# EAGLE design Satellite_Transceiver_Breakout__Swarm_M138 (EAGLE 9.6.2)
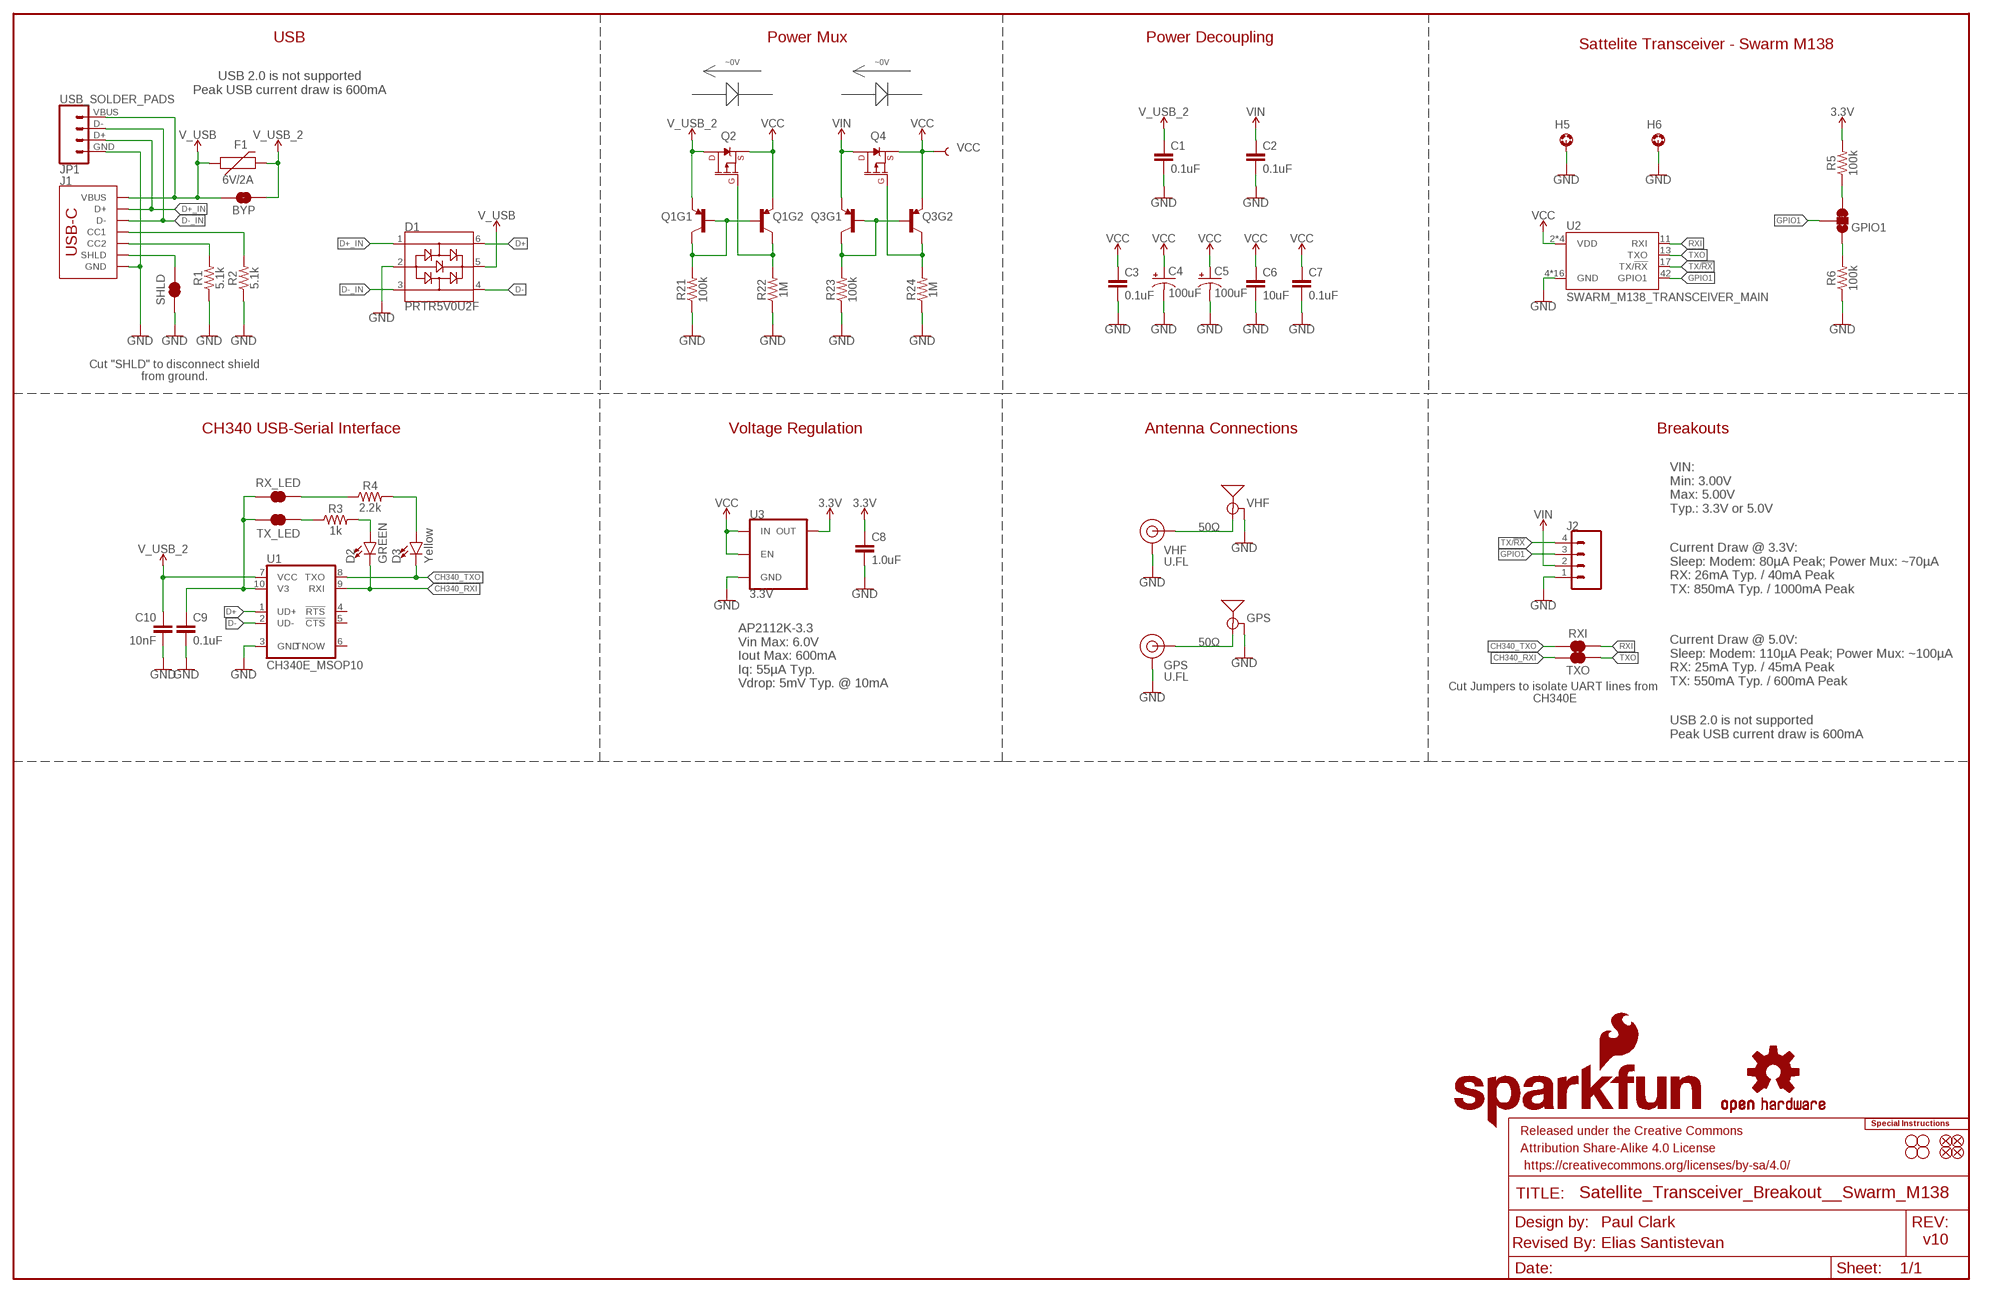
[diagram p0: schematic, sheet 1]

## Parts
BYP  JUMPER-SMT_2_NO_SILK  [SMT-JUMPER_2_NO_SILK]
C1  0.1uF  0.1UF-0603-25V-5%  [0603]
C2  0.1uF  0.1UF-0603-25V-5%  [0603]
C3  0.1uF  0.1UF-0603-25V-5%  [0603]
C4  100uF  100UF-POLAR-25V-20%(ELEC)  [PANASONIC_D]
C5  100uF  100UF-POLAR-25V-20%(ELEC)  [PANASONIC_D]
C6  10uF  10UF-0603-6.3V-20%  [0603]
C7  0.1uF  0.1UF-0603-25V-5%  [0603]
C8  1.0uF  1.0UF-0603-16V-10%-X7R  [0603]
C9  0.1uF  0.1UF-0603-25V-5%  [0603]
C10  10nF  10NF-0603-50V-10%  [0603]
D1  PRTR5V0U2F  [SOT886]
D2  GREEN  LED-GREEN0603  [LED-0603]
D3  Yellow  LED-YELLOW0603  [LED-0603]
E1  VHF  ANTENNA-SMA-GROUNDEDEDGE_SMA  [SMA-EDGE]
E2  GPS  ANTENNA-SMA-GROUNDEDEDGE_SMA  [SMA-EDGE]
F1  6V/2A  PPTC_6V2A  [1210]
FD1  FIDUCIAL1X2  [FIDUCIAL-1X2]
FD2  FIDUCIAL1X2  [FIDUCIAL-1X2]
FD3  FIDUCIAL1X2  [FIDUCIAL-1X2]
FD4  FIDUCIAL1X2  [FIDUCIAL-1X2]
FRAME1  FRAME-LEDGER  [CREATIVE_COMMONS]
GPIO1  JUMPER-SMT_3_1-NC_TRACE_SILK  [SMT-JUMPER_3_1-NC_TRACE_SILK]
GPS  U.FL  U.FL2PIN  [U.FL]
H1  STAND-OFF  [STAND-OFF]
H2  STAND-OFF  [STAND-OFF]
H3  STAND-OFF  [STAND-OFF]
H4  STAND-OFF  [STAND-OFF]
H5  STAND-OFF-REFLOW-M2.5_1.5MM_TALL  [STAND-OFF-REFLOW-M2.5]
H6  STAND-OFF-REFLOW-M2.5_1.5MM_TALL  [STAND-OFF-REFLOW-M2.5]
J1  USB_C_2-LAYER_PADS  [USB-C-16P-2LAYER-PADS]
J2  CONN_041X04_NO_SILK  [1X04_NO_SILK]
JP1  USB_SOLDER_PADS  [USB-SOLDER-PADS]
LOGO1  SPECIAL_INSTRUCTIONS-ORDERING  [ORDERING_INSTRUCTIONS]
LOGO2  OSHW-LOGOM  [OSHW-LOGO-M]
LOGO4  SFE_LOGO_NAME_FLAME.1_INCH  [SFE_LOGO_NAME_FLAME_.1]
Q1  TRANS_PNP_DUALSOT-363  [SOT363_PHILIPS]
Q2  20V/4.2A/52mΩ/1.4W  MOSFET_PCH-DMG2305UX-7  [SOT23-3]
Q3  TRANS_PNP_DUALSOT-363  [SOT363_PHILIPS]
Q4  20V/4.2A/52mΩ/1.4W  MOSFET_PCH-DMG2305UX-7  [SOT23-3]
R1  5.1k  5.1KOHM5.1KOHM-0603-1/10W-1%  [0603]
R2  5.1k  5.1KOHM5.1KOHM-0603-1/10W-1%  [0603]
R3  1k  1KOHM-0603-1/10W-1%  [0603]
R4  2.2k  2.2KOHM-0603-1/10W-1%  [0603]
R5  100k  100KOHM-0603-1/10W-1%  [0603]
R6  100k  100KOHM-0603-1/10W-1%  [0603]
R21  100k  100KOHM-0603-1/10W-1%  [0603]
R22  1M  1MOHM-0603-1/4W-5%  [0603]
R23  100k  100KOHM-0603-1/10W-1%  [0603]
R24  1M  1MOHM-0603-1/4W-5%  [0603]
RX_LED  JUMPER-SMT_2_NC_TRACE_SILK  [SMT-JUMPER_2_NC_TRACE_SILK]
RXI  JUMPER-COMBO_2_NC_TRACE  [COMBO-JUMPER_2_NC_TRACE]
SHLD  JUMPER-SMT_2_NC_TRACE_SILK  [SMT-JUMPER_2_NC_TRACE_SILK]
TX_LED  JUMPER-SMT_2_NC_TRACE_SILK  [SMT-JUMPER_2_NC_TRACE_SILK]
TXO  JUMPER-COMBO_2_NC_TRACE  [COMBO-JUMPER_2_NC_TRACE]
U1  CH340E_MSOP10  [MSOP10]
U2  SWARM_M138_TRANSCEIVER_MAIN  [M.2-SWARM-M138-A]
U3  3.3V  V_REG_AP2112K-3.3V  [SOT23-5]
VCC  TEST-POINT3X5  [PAD.03X.05]
VHF  U.FL  U.FL2PIN  [U.FL]

## Nets
3.3V: C8.1 R5.2 U3.5(OUT)
CH340_RXI: D2.C TXO.2 TXO.4 U1.9(RXI)
CH340_TXO: D3.C RXI.1 RXI.3 U1.8(TXO)
D+: D1.6 U1.1(UD+)
D+_IN: D1.1 J1.A6(D+) J1.B6(D+) JP1.D+
D-: D1.4 U1.2(UD-)
D-_IN: D1.3 J1.A7(D-) J1.B7(D-) JP1.D-
GND: C1.2 C2.2 C3.2 C4.- C5.- C6.2 C7.2 C8.2 C9.2 C10.2 D1.2 E1.GND@0(GND) E1.GND@1(GND) E1.GND@2(GND) E1.GND@3(GND) E2.GND@0(GND) E2.GND@1(GND) E2.GND@2(GND) E2.GND@3(GND) GPS.1(GND) GPS.2(GND) H5.1 H6.1 J1.GND J1.GND2(GND) J2.1 JP1.GND R1.1 R2.1 R6.1 R21.1 R22.1 R23.1 R24.1 SHLD.1 U1.3(GND) U2.4(GND) U2.9(GND) U2.15(GND) U2.18(GND) U2.21(GND) U2.26(GND) U2.27(GND) U2.29(GND) U2.34(GND) U2.35(GND) U2.37(GND) U2.40(GND) U2.43(GND) U2.50(GND) U2.A1(GND) U2.A2(GND) U3.2(GND) VHF.1(GND) VHF.2(GND)
GPIO1: GPIO1.2 J2.3 U2.42(GPIO1)
GPS [RF]: E2.SIG(SIGNAL) GPS.FEED(SIGNAL)
N$2: J1.B5(CC2) R1.2
N$3: J1.A5(CC1) R2.2
N$5: Q1.2(B) Q1.5(B) Q1.6(C) R21.2
N$6: C9.1 RX_LED.1 TX_LED.2 U1.10(V3)
N$7: R4.1 RX_LED.2
N$9: D2.A R3.2
N$10: D3.A R4.2
N$12: R3.1 TX_LED.1
N$13: Q1.3(C) Q2.1(G) R22.2
N$14: GPIO1.3 R5.1
N$15: Q3.2(B) Q3.5(B) Q3.6(C) R23.2
N$16: GPIO1.1 R6.2
N$28: Q3.3(C) Q4.1(G) R24.2
RXI: RXI.2 RXI.4 U2.11(RXI)
SHLD: J1.SHLD1(SHLD) J1.SHLD2(SHLD) J1.SHLD3(SHLD) J1.SHLD4(SHLD) SHLD.2
TX/!RX!: J2.4 U2.17(TX/!RX!)
TXO: TXO.1 TXO.3 U2.13(TXO)
V_USB: BYP.2 D1.5 F1.1 J1.VBUS1(VBUS) J1.VBUS2(VBUS) JP1.VBUS
V_USB_2: BYP.1 C1.1 C10.1 F1.2 Q1.1(E) Q2.3(D) U1.7(VCC)
VCC: C3.1 C4.+ C5.+ C6.1 C7.1 Q1.4(E) Q2.2(S) Q3.4(E) Q4.2(S) U2.2(VDD) U2.39(VDD) U2.41(VDD) U2.52(VDD) U3.1(IN) U3.3(EN) VCC.1
VHF [RF]: E1.SIG(SIGNAL) VHF.FEED(SIGNAL)
VIN: C2.1 J2.2 Q3.1(E) Q4.3(D)
Unconnected: U1.4(!RTS) U1.5(!CTS) U1.6(TNOW)

## Notes on the sheet
- USB | Power Mux | Power Decoupling
- Sattelite Transceiver - Swarm M138
- ~0V | ~0V
- USB 2.0 is not supported
  Peak USB current draw is 600mA
- Cut "SHLD" to disconnect shield
  from ground.
- CH340 USB-Serial Interface | Voltage Regulation | Antenna Connections | Breakouts
- VIN:
  Min: 3.00V
  Max: 5.00V
  Typ.: 3.3V or 5.0V
- 50Ω
- Current Draw @ 3.3V:
  Sleep: Modem: 80µA Peak; Power Mux: ~70µA
  RX: 26mA Typ. / 40mA Peak
  TX: 850mA Typ. / 1000mA Peak
- AP2112K-3.3
  Vin Max: 6.0V
  Iout Max: 600mA
  Iq: 55µA Typ.
  Vdrop: 5mV Typ. @ 10mA
- Current Draw @ 5.0V:
  Sleep: Modem: 110µA Peak; Power Mux: ~100µA
  RX: 25mA Typ. / 45mA Peak
  TX: 550mA Typ. / 600mA Peak
- 50Ω
- Cut Jumpers to isolate UART lines from 
  CH340E
- USB 2.0 is not supported
  Peak USB current draw is 600mA
- Paul Clark
- Revised By: Elias Santistevan | v10

## Library data of the parts
BYP = SparkFun-Jumpers:JUMPER-SMT_2_NO: Normally open jumper This jumper has two pads in close proximity to each other. Apply solder to close the connection. Round pads are easier to solder for beginners, but are a lot larger. SparkFun Product that uses the round pads: SparkFun EL Sequencer <https://www.sparkfun.com/products/12781>
C1-C3 C7 C9 = SparkFun-Capacitors:0.1UF: 0.1µF ceramic capacitors A capacitor is a passive two-terminal electrical component used to store electrical energy temporarily in an electric field.; PROD_ID: CAP-08604
C4 C5 = SparkFun-Capacitors:100UF-POLAR: 100µF polarized capacitors A capacitor is a passive two-terminal electrical component used to store electrical energy temporarily in an electric field.; PROD_ID: CAP-12547
C6 = SparkFun-Capacitors:10UF: 10.0µF ceramic capacitors A capacitor is a passive two-terminal electrical component used to store electrical energy temporarily in an electric field.; PROD_ID: CAP-11015
C8 = SparkFun-Capacitors:1.0UF: 1µF ceramic capacitors A capacitor is a passive two-terminal electrical component used to store electrical energy temporarily in an electric field.; PROD_ID: CAP-13930
C10 = SparkFun-Capacitors:10NF: 0.01uF/10nF/10,000pF ceramic capacitors A capacitor is a passive two-terminal electrical component used to store electrical energy temporarily in an electric field. CAP-09321; PROD_ID: CAP-00867
D1 = SparkFun-IC-Power:PRTR5V0U2: A small ESD protection device. Most commonly used on USB D+/D- signals to protect large, expensive, or especially sensitive USB enabled devices.; PROD_ID: DIO-14084
D2 = SparkFun-LED:LED-GREEN: Green SMD LED Used in manufacturing of various products at SparkFun Packages: 0603 - SMD 0603 package [Product Link] <http://www.futureelectronics.com/en/technologies/semiconductors/optoelectronics/leds/Pages/9894312-LTST-C190GKT.aspx?CrossPart=HSMG-C190&IM=0> LilyPad 1206 - SMD1206 LilyPad package [Product Link] <http://www.futureelectronics.com/en/Technologies/Product.aspx?ProductID=IN150NGHARVATEKCORPORATION2049943&IM=0> 1206 - SMD1206 package [Product Link] <http://www.futureelectronics.com/en/technologies/semiconductors/optoelectronics/leds/Pages/8315665-LTST-C150KGKT.aspx?IM=0> 1206 Bottom Mount -SMD 1206 Bottom Mount [Product Link] <http://www.digikey.com/product-detail/en/lite-on-inc/LTST-C230KGKT/160-1456-1-ND/386854> SparkFun Products: Pro Mini 328 -5V <https://www.sparkfun.com/products/821> RedBoard <https://www.sparkfun.com/products/12757> MP3 Trigger <https://www.sparkfun.com/products/13720> Makey Makey <https://www.sparkfun.com/products/11076>; PROD_ID: DIO-00821
D3 = SparkFun-LED:LED-YELLOW: Yellow SMD LED Used in manufacturing several products at SparkFun. Packages: 0603 - SMD 0603 package[Product Link] <http://www.kingbrightusa.com/product.asp?catalog_name=LED&product_id=APT1608SYCK> 0603 -SMART - SMART SMD 0603 package (more efficient/more expensive) [Product Link] <http://www.osram-os.com/osram_os/en/products/product-catalog/led-light-emitting-diodes/smartled-0603/ly-l29k/index.jsp> LilyPad - SMD1206 package[Product Datasheet] <https://www.sparkfun.com/datasheets/DevTools/LilyPad/Q150YUS4.pdf> SparkFun Products: Blynk Board <https://www.sparkfun.com/products/13794> IOIO-OTG <https://www.sparkfun.com/products/13613> XBee Explorer Serial <https://www.sparkfun.com/products/13225>; PROD_ID: DIO-09003
E1 E2 = SparkFun-RF:ANTENNA-SMA-GROUNDED: SMA Antenna Connector w/ Ground Edge-mount and SMD SMA connectors for RF Antennas. **4-LAYER BOARD WARNING!!** When designing a 4-layer board using any of the SMD variants, you will need to manually add a cutout polygon on any internal power layers to make sure that you don't end up with exposed copper around the edge of the routed hole for these connectors. Exposed power copper could then short to the connector body - and that would be bad. Why hasn't anyone added the cutout polygons directly to the connector footprint? Well, your internal layers (usually 2 and 15) may be covered with GND polygons and you might well want the copper to go all the way to the edge, especially under the connector SIGNAL pin. So adding cutouts to the footprint might make matters worse, not better...; PROD_ID: CONN-08289
F1 = SparkFun-Fuses:PPTC: Resettable Fuse PPTC Resettable Fuse. Really a sort of resistor with a polymeric positive temperature coefficient whose resistance increases dramatically with an increase in temperature. When heated by the power passing through the resistance rises causing the current to be limited, protecting the circuit. This is achieved by the transition of the polymer from a crystalline to an amorphous state where the conductive carbon separates breaking the conductive pathways found in the cool crystalline structure. When a PPTC cools back down it resumes conducting letting the circuit turn back on. SparkFun Products: SparkFun RedBoard - Programmed with Arduino <https://www.sparkfun.com/products/12757> Pro Micro - 5V/16MHz <https://www.sparkfun.com/products/12640> Arduino Pro 328 - 5V/16MHz <https://www.sparkfun.com/products/10915> MP3 Trigger <https://www.sparkfun.com/products/13720>; PROD_ID: RES-14313
FD1-FD4 = SparkFun-Aesthetics:FIDUCIAL: Fiducial Alignment Points Point-of-reference for pick-and-place machines and other optical instruments.
FRAME1 = SparkFun-Aesthetics:FRAME-LEDGER: Schematic Frame - Ledger Standard 11x14 US Ledger frame
GPIO1 = SparkFun-Jumpers:JUMPER-SMT_3_1-NC_TRACE: Normally closed trace jumper (1 of 2 connections) This jumper has a trace between two pads so it's normally closed (NC). The other connection is normally open (NO). Use a razor knife to open the connection. For best results follow the IPC guidelines for cutting traces: Cutout at least 0.063 mm (0.005 in). Remove all loose material to clean up the cut area. Seal the cut with an approved epoxy. Reapply solder to reclose the connection, or to close the NO connection.
GPS VHF = SparkFun-Connectors:U.FL2PIN: SMD Antenna Connector - U.FL 2mm height, 3.0mm x 3.0mm receptacle size. SparkFun Products: SparkFun WiFi Shield - ESP8266 <https://www.sparkfun.com/products/13287> SparkFun ESP8266 Thing <https://www.sparkfun.com/products/13231> SparkFun MiniGen - Pro Mini Signal Generator Shield <https://www.sparkfun.com/products/11420>; PROD_ID: CONN-09193; SF_ID: WRL-09144
H1-H4 = SparkFun-Hardware:STAND-OFF: Stand Off Drill holes for mechanically mounting via screws, standoffs, etc. Note: Use the keepout ring to avoid running the screw head into surrounding components. Variant Overviews STAND-OFF - Mechanical footprint for a #4 phillips button head screw. STAND-OFF-TIGHT - Mechanical footprint for a #4 phillips button head screw, Example SparkFun Products Screw - Phillips Head (1/4", 4-40, 10 pack) <https://www.sparkfun.com/products/10453> (PRT-10453) Screw - Phillips Head (1/2", 4-40, 10 pack) <https://www.sparkfun.com/products/10452> (PRT-10452) Screw - Phillips Head (3/4", 4-40, 10 pack) <https://www.sparkfun.com/products/10451> (PRT-10451) Screw - Phillips Head (1", 4-40, 10 pack) <https://www.sparkfun.com/products/10450> (PRT-10450)
H5 H6 = SparkFun-Hardware:STAND-OFF-REFLOW: Stand Off Reflow Compatible A metal standoff that can be placed and reflowed onto a PCB. The M2.5 x 2.5mm variant is used on MicroMod. The M2.5 x 1.5mm variant is used to hold mPCIe boards, including the Swarm M138. The M2.0 x 6.0mm variant is used to mount the Iridium 9603N modem.; PROD_ID: HW-16629
J1 = SparkFun-Connectors:USB_C: USB Type C 16Pin Connector Super Speed pins not available on the 16-pin purely SMD connector so this part is best for USB 2.0 implementations. D1 and D2 are tied together enabling D+/- no matter which way the cable is plugged into the connector. The two channel configuration pins (CC1/2) are exposed. These are normally connected to ground via 5.1k resistors but can be reconfigured for high current/high power applications. **4-LAYER BOARD WARNING!!** If designing 4-layer board, make sure to select the variant _4-LAYER-ISOLATED. The linked footprint (USB-C-16-4LAYER-ISOLATED) includes some very necessary cutout polygons in the inner layers (2 and 15). This prevents the PTH mounting shield legs on the USB connector from electrically connecting any other polygons on the inner layers (usually VCC and GND).; PROD_ID: CONN-14122
J2 = SparkFun-Connectors:CONN_04: Multi connection point. Often used as Generic Header-pin footprint for 0.1 inch spaced/style header connections On any of the 0.1 inch spaced packages, you can populate with these: Break Away Headers - Straight <https://www.sparkfun.com/products/116> (PRT-00116) Break Away Male Headers - Right Angle <https://www.sparkfun.com/products/553> (PRT-00553) Female Headers <https://www.sparkfun.com/products/115> (PRT-00115) Break Away Headers - Machine Pin <https://www.sparkfun.com/products/117> (PRT-00117) Break Away Female Headers - Swiss Machine Pin <https://www.sparkfun.com/products/743> (PRT-00743) For SCREWTERMINALS and SPRING TERMINALS visit here: Screw Terimnals on SparkFun.com <https://www.sparkfun.com/search/results?term=Screw+Terminals> (5mm/3.5mm/2.54mm spacing) This device is also useful as a general connection point to wire up your design to another part of your project. Our various solder wires solder well into these plated through hole pads. Hook-Up Wire - Assortment (Stranded, 22 AWG) <https://www.sparkfun.com/products/11375> (PRT-11375) Hook-Up Wire - Assortment (Solid Core, 22 AWG) <https://www.sparkfun.com/products/11367> (PRT-11367) View the entire wire category on our website here <https://www.sparkfun.com/categories/141> Special notes: Molex polarized connector foot print use with SKU : PRT-08231 with associated crimp pins and housings. 1MM SMD Version SKU: PRT-10208; PROD_ID: CONN-09696
JP1 = SparkFun-Connectors:USB_SOLDER_PADS: Solder pad access to USB pins. Helpful to expose on PCBs so user can attach external USB connector if necessary.
LOGO1 = SparkFun-Aesthetics:SPECIAL_INSTRUCTIONS: Special Ordering/Production Instructions Alert Symbol for special PCB ordering instructions or unique production process warnings. Ordering Instructions Production Instructions Types of information that should be added to box: Copper weight Soldermask color Silk color PCB thickness Number of layers PCB Standard: 1.6mm FR4 1 oz copper immersion silver plating red soldermask white silkscreen Types of information that should be added to box: Special wash requirements Depaneling instructions Humidification Glue curing Default text settings: 0.07 inch 9% ratio 50% line distance
LOGO2 = SparkFun-Aesthetics:OSHW-LOGO: Open-Source Hardware (OSHW) Logo This logo indicates the piece of hardware it is found on incorporates a OSHW license and/or adheres to the definition of open source hardware found here: http://freedomdefined.org/OSHW
LOGO4 = SparkFun-Aesthetics:SFE_LOGO_NAME_FLAME: SparkFun Font Logo w/ Flame This is the SparkFun full logo. The logo on the schematic will always be the same size; the package variant is the height of the flame part of the logo. Default layer for the logo on the board is tSilk.
Q1 Q3 = SparkFun-DiscreteSemi:TRANS_PNP_DUAL: Dual PNP Transistors in Single Package The BCM857BS puts two PNP transistors in a single package. Bipolar (BJT) Transistor Array 2 PNP (Dual) 45V 100mA 100MHz 200mW Surface Mount SOT-363 Datasheet <https://www.diodes.com/assets/Datasheets/BCM857BS.pdf> SparkFun Products: SparkFun Pi Servo HAT V2 <https://www.sparkfun.com>; PROD_ID: TRANS-14386
Q2 Q4 = SparkFun-DiscreteSemi:MOSFET_PCH: P-channel MOSFETs Voltage controlled devices that allow control of high current outputs. SparkFun Products: SparkFun ESP32 Thing <https://www.sparkfun.com/products/13907> SparkFun ESP8266 Thing <https://www.sparkfun.com/products/13231> SparkFun Pi Servo HAT V2 <https://www.sparkfun.com/products/15316> DMG2305UX-7 (20V/4.2A/SOT23-3); PROD_ID: TRANS-14388
R1 R2 = SparkFun-Resistors:5.1KOHM; PROD_ID: RES-12083
R3 = SparkFun-Resistors:1KOHM: 1kΩ resistor A resistor is a passive two-terminal electrical component that implements electrical resistance as a circuit element. Resistors act to reduce current flow, and, at the same time, act to lower voltage levels within circuits. - Wikipedia; PROD_ID: RES-07856
R4 = SparkFun-Resistors:2.2KOHM: 2.2kΩ resistor A resistor is a passive two-terminal electrical component that implements electrical resistance as a circuit element. Resistors act to reduce current flow, and, at the same time, act to lower voltage levels within circuits. - Wikipedia; PROD_ID: RES-08272
R5 R6 R21 R23 = SparkFun-Resistors:100KOHM: 100kΩ resistor A resistor is a passive two-terminal electrical component that implements electrical resistance as a circuit element. Resistors act to reduce current flow, and, at the same time, act to lower voltage levels within circuits. - Wikipedia; PROD_ID: RES-07828
R22 R24 = SparkFun-Resistors:1MOHM: 1MΩ resistor A resistor is a passive two-terminal electrical component that implements electrical resistance as a circuit element. Resistors act to reduce current flow, and, at the same time, act to lower voltage levels within circuits. - Wikipedia; PROD_ID: RES-07868
RX_LED SHLD TX_LED = SparkFun-Jumpers:JUMPER-SMT_2_NC_TRACE: Normally closed trace jumper This jumper has a trace between two pads so it's normally closed (NC). Use a razor knife to open the connection. For best results follow the IPC guidelines for cutting traces: Cutout at least 0.063 mm (0.005 in). Remove all loose material to clean up the cut area. Seal the cut with an approved epoxy. Reapply solder to reclose the connection.
RXI TXO = SparkFun-Jumpers:JUMPER-COMBO_2_NC_TRACE
U1 = SparkFun-IC-Comms:CH340E; PROD_ID: IC-14135
U2 = SparkFun-RF:SWARM_M138_TRANSCEIVER: Swarm M138 Modem Description: A satellite transceiver based on the mPCIe standard.; PROD_ID: CONN-16558
U3 = SparkFun-IC-Power:V_REG_AP2112: AP2112 - 600mA CMOS LDO Regulator w/ Enable The AP2112 is CMOS process low dropout linear regulator with enable function, the regulator delivers a guaranteed 600mA (min.) continuous load current. Features Output Voltage Accuracy: ±1.5% Output Current: 600mA (Min.) Foldback Short Current Protection: 50mA Enable Function to Turn ON/OFF VOUT Low Dropout Voltage (3.3V): 250mV (Typ.) @IOUT=600mA Excellent Load Regulation: 0.2%/A (Typ.) Excellent Line Regulation: 0.02%/V (Typ.) Low Quiescent Current: 55μA (Typ.) Low Standby Current: 0.01μA (Typ.) Low Output Noise: 50μVRMS PSRR: 100Hz -65dB, 1kHz -65dB OTSD Protection Stable with 1.0μF Flexible Cap: Ceramic, Tantalum and Aluminum Electrolytic Operation Temperature Range: -40°C to 85°C ESD: MM 400V, HBM 4000V; PROD_ID: VREG-12457
VCC = SparkFun-Connectors:TEST-POINT: SparkFun Test Points Bare copper test points for troubleshooting or In-Circuit-Testing. These are used by our Production team for verifying production board runs using pogo-pins on test beds. SparkFun Products: SparkFun LSM9DS1 Breakout <https://www.sparkfun.com/products/13284> SparkFun PSOC <https://www.sparkfun.com/products/13714> SparkFun Load Cell Amplifier <https://www.sparkfun.com/products/13879>

## Net classes
1 RF: clearance 0.254 mm

## Board
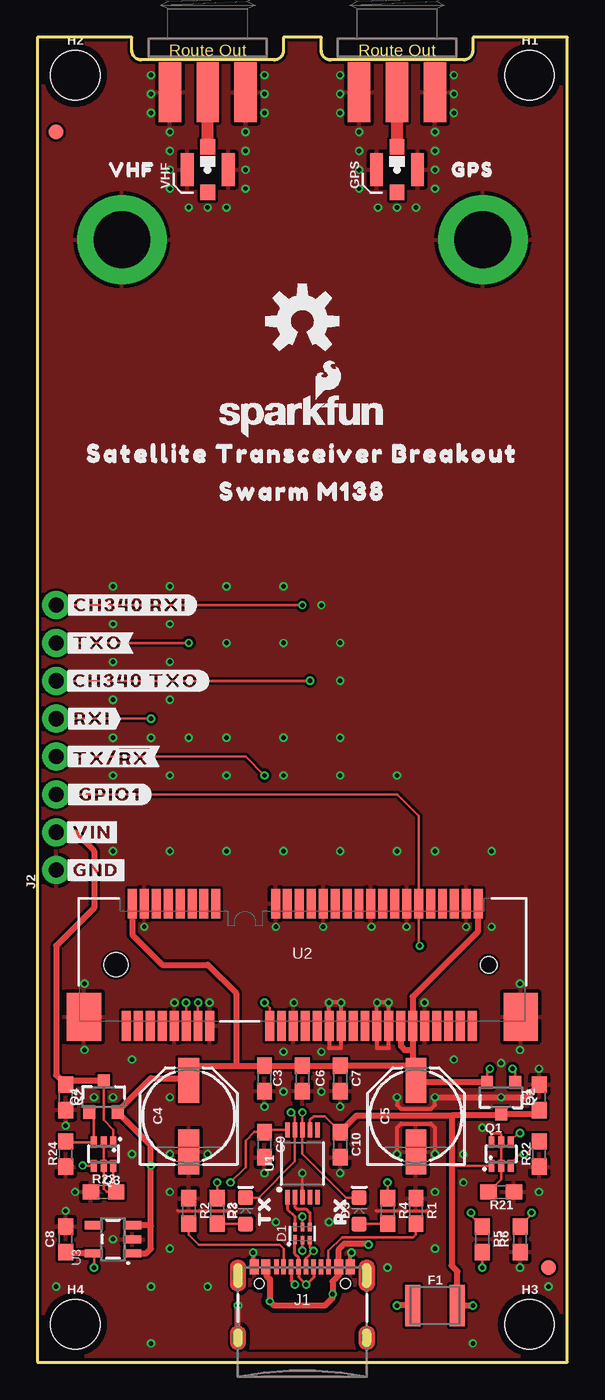
[diagram p1: board, top side]
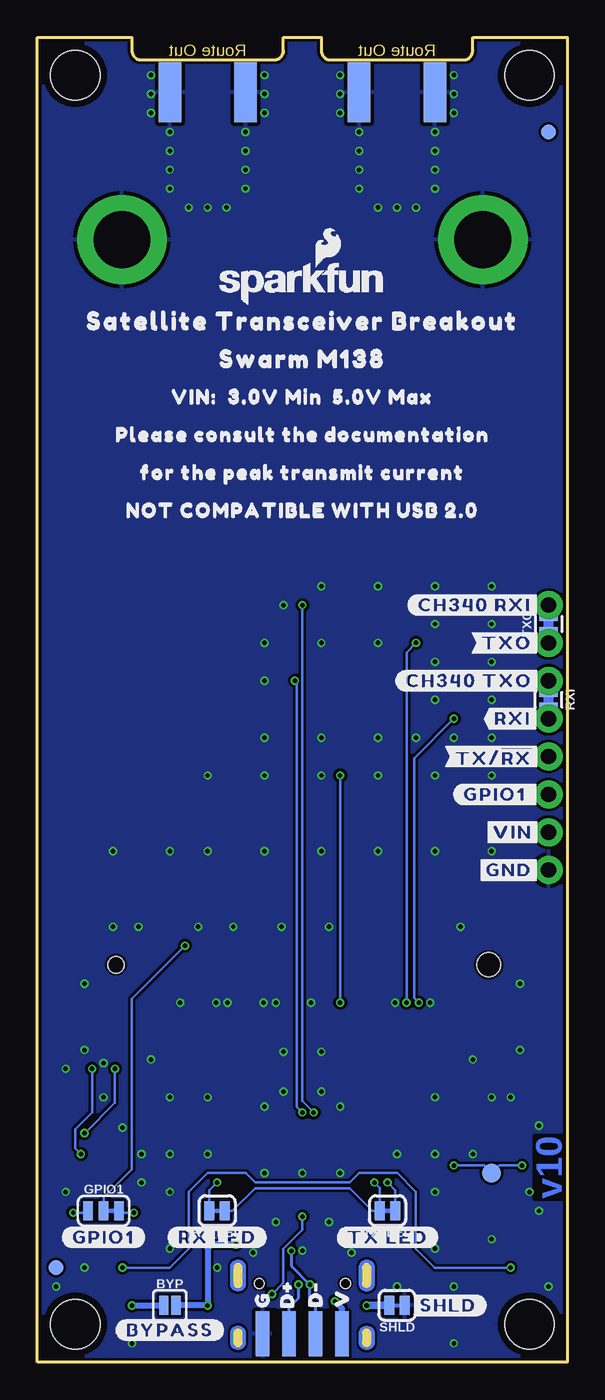
[diagram p2: board, bottom side, seen from below]

Size 35.56 x 88.9 mm. Coordinates in mm from the lower left corner, seen from the top.
Outline: 0,0 35.56,0 35.56,88.9 29.21,88.9 29.21,88.01 arc-90 28.57,87.38 19.68,87.38 arc-90 19.05,88.01 19.05,88.9 16.51,88.9 16.51,88.01 arc-90 15.88,87.38 6.99,87.38 arc-90 6.35,88.01 6.35,88.9 0,88.9 0,0
Copper layers (1*16): Top 0.035mm / dielectric 1.5mm / Bottom 0.035mm
Design rules "SparkFun-2-Layer-Minimum-JLCPCB": minimum track width 5mil, minimum drill 0.3mm, track to track 5mil, track to pad 5mil, pad to pad 5mil, via to via 5mil, smd to smd 5mil, copper to edge 7mil, drill to drill 7mil, minimum pad ring 5mil, minimum via ring 5mil, stop-mask expansion 2.5mil, vias tented up to drill 25mil, thermal gap 10mil
tRestrict: area 10.7,79.1 to 12.2,80.9; area 23.4,79.1 to 24.9,80.9; 4 lines
bRestrict: 3 lines

### Footprints (pad centres in the part's own frame; a part is rotated, then mirrored left to right if it is on the bottom)
SMT-JUMPER_2_NO_SILK = smd 0.635 x 1.27: 1 -0.406,0; 2 0.406,0
0603 = smd 1.1 x 1: 1 -0.85,0; 2 0.85,0
PANASONIC_D = smd 3 x 1.4: + 2.4,0; - -2.4,0
SOT886 = smd 0.61 x 0.25: 1 -0.405,0.5 | smd 0.56 x 0.25: 2 -0.43,0; 3 -0.43,-0.5; 4 0.43,-0.5; 5 0.43,0; 6 0.43,0.5
LED-0603 = smd 1 x 1: A -0.877,0; C 0.877,0
SMA-EDGE = smd 1.5 x 4: GND@0 -2.54,0; GND@1 2.54,0; SIG 0,0 | smd 1.5 x 4 bottom: GND@2 -2.54,0; GND@3 2.54,0
1210 = smd 1 x 2.8: 1 -1.5,0; 2 1.5,0
FIDUCIAL-1X2 = smd 1 x 1: 1 0,0
SMT-JUMPER_3_1-NC_TRACE_SILK = smd 0.66 x 1.27: 1 -1.041,0; 2 0,0; 3 1.041,0
U.FL = smd 2.2 x 0.85: 1 0,1.375; 2 0,-1.375 | smd 1.05 x 1: FEED 1.525,0; NC -1.525,0
STAND-OFF = hole 3.302: 0,0
STAND-OFF-REFLOW-M2.5 = drill 3.8 pad 6: 1 0,0
USB-C-16P-2LAYER-PADS = smd 0.3 x 1: A5 -1.25,-0.34; A6 -0.25,-0.34; A7 0.25,-0.34; A8 1.25,-0.34; B5 1.75,-0.34; B6 0.75,-0.34; B7 -0.75,-0.34; B8 -1.75,-0.34 | smd 0.6 x 1: GND -3.225,-0.34; GND2 3.225,-0.34; VBUS1 -2.45,-0.34; VBUS2 2.45,-0.34 | drill 0.4 pad 0.6 long: SHLD1 -4.318,-0.915; SHLD2 4.318,-0.915; SHLD3 -4.318,-5.095; SHLD4 4.318,-5.095 | hole 0.65: -2.89,-1.445; 2.89,-1.445
1X04_NO_SILK = drill 1.016 pad 1.88: 1 0,0; 2 2.54,0; 3 5.08,0; 4 7.62,0
USB-SOLDER-PADS = smd 3 x 0.9: D+ 0,-0.889; D- 0,0.889; GND 0,-2.667; VBUS 0,2.667
SOT363_PHILIPS = smd 0.4 x 0.8: 1 -0.65,-0.8; 2 0,-0.8; 3 0.65,-0.8; 4 0.65,0.8; 5 0,0.8; 6 -0.65,0.8
SOT23-3 = smd 0.8 x 0.9: 1 -0.95,-1; 2 0.95,-1; 3 0,1.1
SMT-JUMPER_2_NC_TRACE_SILK = smd 0.66 x 1.27: 1 -0.521,0; 2 0.521,0
COMBO-JUMPER_2_NC_TRACE = smd 0.635 x 1.27: 1 -0.508,0; 2 0.508,0 | drill 1.016 pad 1.88: 3 -1.27,0; 4 1.27,0
MSOP10 = smd 1 x 0.3: 1 -2.25,1; 2 -2.25,0.5; 3 -2.25,0; 4 -2.25,-0.5; 5 -2.25,-1; 6 2.25,-1; 7 2.25,-0.5; 8 2.25,0; 9 2.25,0.5; 10 2.25,1
M.2-SWARM-M138-A = smd 0.6 x 2: 1 -11.8,-4.1; 2 -11.4,4.1; 3 -11,-4.1; 4 -10.6,4.1; 5 -10.2,-4.1; 6 -9.8,4.1; 7 -9.4,-4.1; 8 -9,4.1; 9 -8.6,-4.1; 10 -8.2,4.1; 11 -7.8,-4.1; 12 -7.4,4.1; 13 -7,-4.1; 14 -6.6,4.1; 15 -6.2,-4.1; 16 -5.8,4.1; 17 -2.2,-4.1; 18 -1.8,4.1; 19 -1.4,-4.1; 20 -1,4.1; 21 -0.6,-4.1; 22 -0.2,4.1; 23 0.2,-4.1; 24 0.6,4.1; 25 1,-4.1; 26 1.4,4.1; 27 1.8,-4.1; 28 2.2,4.1; 29 2.6,-4.1; 30 3,4.1; 31 3.4,-4.1; 32 3.8,4.1; 33 4.2,-4.1; 34 4.6,4.1; 35 5,-4.1; 36 5.4,4.1; 37 5.8,-4.1; 38 6.2,4.1; 39 6.6,-4.1; 40 7,4.1; 41 7.4,-4.1; 42 7.8,4.1; 43 8.2,-4.1; 44 8.6,4.1; 45 9,-4.1; 46 9.4,4.1; 47 9.8,-4.1; 48 10.2,4.1; 49 10.6,-4.1; 50 11,4.1; 51 11.4,-4.1; 52 11.8,4.1 | smd 2.3 x 3.2: A1 -14.65,-3.5; A2 14.65,-3.5 | hole 1.1: 12.5,0 | hole 1.6: -12.5,0
SOT23-5 = smd 0.55 x 1.2: 1 -0.95,-1.3; 2 0,-1.3; 3 0.95,-1.3; 4 0.95,1.3; 5 -0.95,1.3
PAD.03X.05 = smd 1.27 x 1.27: 1 0,0

### Placement (x,y rotation side)
BYP  26.67,3.81 0 bottom
C1  33.66,17.78 90 top
C2  1.91,17.78 270 top
C3  15.24,19.05 270 top
C4  10.16,16.51 90 top
C5  25.4,16.51 90 top
C6  17.78,19.05 270 top
C7  20.32,19.05 270 top
C8  1.91,8.26 90 top
C9  15.24,14.61 270 top
C10  20.32,14.61 270 top
D1  17.78,8.64 90 top
D2  13.97,10.16 90 top
D3  21.59,10.16 90 top
E1  11.43,85.22 0 top
E2  24.13,85.22 0 top
F1  26.67,3.81 0 top
FD1  34.29,6.35 0 top
FD2  34.29,6.35 0 bottom
FD3  1.27,82.55 0 top
FD4  1.27,82.55 0 bottom
FRAME1  71.12,10.16 0 top  (outside the outline)
GPIO1  31.11,10.16 0 bottom
GPS  24.13,80.01 90 top
H1  33.02,86.36 0 top
H2  2.54,86.36 0 top
H3  33.02,2.54 0 top
H4  2.54,2.54 0 top
H5  5.68,75.32 0 top
H6  29.88,75.32 0 top
J1  17.78,6.73 0 top
J2  1.27,33.02 90 top
JP1  17.78,1.91 270 bottom
LOGO1  43.18,69.85 0 top  (outside the outline)
LOGO2  17.78,69.85 0 top
LOGO3  SFE_LOGO_NAME_FLAME.1_INCH  [SFE_LOGO_NAME_FLAME_.1]  17.78,72.39 0 bottom
LOGO4  17.78,63.5 0 top
Q1  31.11,13.97 0 top
Q2  31.11,17.78 180 top
Q3  4.45,13.97 180 top
Q4  4.45,17.78 0 top
R1  25.4,10.16 270 top
R2  10.16,10.16 270 top
R3  12.06,10.16 270 top
R4  23.5,10.16 270 top
R5  29.84,8.26 270 top
R6  32.38,8.26 90 top
R21  31.11,11.43 180 top
R22  33.66,13.97 90 top
R23  4.45,11.43 0 top
R24  1.91,13.97 90 top
RX_LED  23.5,10.16 180 bottom
RXI  1.27,44.45 270 bottom
SHLD  11.43,3.81 180 bottom
TX_LED  12.06,10.16 180 bottom
TXO  1.27,49.53 90 bottom
U1  17.78,13.34 90 top
U2  17.78,26.67 0 top
U3  5.08,8.26 90 top
U$1  [#SHLD#14]  8,3.81 0 bottom
U$3  [VHF0]  6.35,80.01 0 top
U$4  [GPS0]  29.21,80.01 0 top
U$5  [VIN#__3#0V_MIN__5#0V_MAX0]  17.78,64.77 0 bottom
U$6  [PLEASE_CONSULT_THE_DOCUMENTATION0]  17.78,62.23 0 bottom
U$7  [#CH340_RXI#0]  6.22,50.8 0 top
U$8  [#CH340_RXI#341]  6.22,50.8 0 bottom
U$9  [#TXO#341]  4.06,48.26 0 top
U$10  [#TXO#342]  4.06,48.26 0 bottom
U$11  [#CH340_TXO#0]  6.6,45.72 0 top
U$12  [#CH340_TXO#341]  6.6,45.72 0 bottom
U$13  [#RXI#0]  3.68,43.18 0 bottom
U$14  [#RXI#1]  3.68,43.18 0 top
U$15  [#TX##RX##1]  4.95,40.64 0 bottom
U$16  [#TX##RX##0]  4.95,40.64 0 top
U$17  [#GPIO1_#2]  4.7,38.1 0 bottom
U$18  [V0]  15.11,4.32 90 bottom
U$19  [#GPIO1#0]  31.11,8.38 0 bottom
U$20  [#_GPIO1#2]  4.7,38.1 0 top
U$21  [#VIN#0]  3.68,35.56 0 top
U$22  [#VIN#0]  3.68,35.56 0 bottom
U$23  [#GND#0]  3.94,33.02 0 top
U$24  [#GND#0]  3.94,33.02 0 bottom
U$25  [TX0]  15.24,10.16 90 top
U$26  [RX0]  20.32,10.16 90 top
U$27  [#TX_LED#0]  12.06,8.38 0 bottom
U$28  [#RX_LED#0]  23.5,8.38 0 bottom
U$29  [#BYPASS#0]  26.67,2.16 0 bottom
U$30  [G3]  20.45,4.19 90 bottom
U$31  [FOR_THE_PEAK_TRANSMIT_CURRENT1]  17.78,59.69 0 bottom
U$32  [NOT_COMPATIBLE_WITH_USB_2#02]  17.78,57.15 0 bottom
U$34  [SATELLITE_TRANSCEIVER_BREAKOUT0]  17.78,60.96 0 top
U$36  [D#2]  18.8,4.57 90 bottom
U$37  [D#1]  16.89,4.57 90 bottom
U$39  [SATELLITE_TRANSCEIVER_BREAKOUT0]  17.78,69.85 0 bottom
U$40  [SWARM_M1381]  17.78,58.42 0 top
U$41  [SWARM_M1381]  17.78,67.31 0 bottom
VCC  5.08,12.7 0 bottom
VHF  11.43,80.01 90 top

### Tracks (layer width: path | path; a pad name or v marks a point on that pad's centre or on a via)
3.3V  (via drill 0.3)
  Top 0.152: U3.5 3.81,7.28 v3.81,6.35 | v29.84,6.35 R5.2
  Top 0.406: U3.5 2,7.3 C8.1
  Bottom 0.152: v29.84,6.35 26.67,6.35 25.4,7.62 25.4,11.43 24.13,12.7 21.59,12.7 20.95,12.06 14.61,12.06 13.97,12.7 11.43,12.7 10.16,11.43 10.16,7.62 8.89,6.35 v3.81,6.35
CH340_RXI  (via drill 0.3)
  Top 0.152: D2.C 14.85,11.04 17.28,13.47 U1.9 17.28,16.5 v17.02,16.76 | TXO.4 v17.78,50.8
  Bottom 0.152: TXO.4 TXO.2 | v17.02,16.76 17.78,17.53 v17.78,50.8
CH340_TXO  (via drill 0.3)
  Top 0.152: D3.C 20.71,11.04 17.78,13.97 U1.8 v17.78,16.76 | v18.29,45.72 RXI.3
  Bottom 0.152: RXI.3 RXI.1 | v17.78,16.76 18.16,17.14 18.16,45.59 v18.29,45.72
D+
  Top 0.203: U1.1 16.78,10.27 17.27,9.78 D1.6
D+_IN  (via drill 0.3)
  Top 0.203: D1.1 17.27,7.29 17.53,7.03 J1.A6 17.53,5.71 v18.03,5.21 18.53,5.7 J1.B6
  Bottom 0.203: v18.03,5.21 18.03,4.32 18.67,3.68 JP1.D+
D-
  Top 0.203: U1.2 17.28,10.41 17.4,10.29 18.03,10.29 18.29,10.03 D1.4
D-_IN  (via drill 0.3)
  Top 0.203: J1.A7 18.03,6.98 v18.52,7.47 18.28,7.71 D1.3 | J1.B7 17.03,5.45 v17.27,5.21
  Bottom 0.203: v18.52,7.47 18.52,6.46 v17.27,5.21 17.27,4.19 16.89,3.81 JP1.D-
GND  (via drill 0.3)
  Top 0.152: v17.78,7.49 D1.2 | U1.3 v17.78,12.7
  Top 0.203: 9.4,10.16 12.95,10.16 | 22.73,10.16 26.29,10.16
  Top 0.254: v24.13,17.78 24.13,17.26 24.38,17.01 26.42,17.01 26.67,17.26 v26.67,17.78 | v24.13,13.97 24.13,15.75 24.38,16 26.42,16 26.67,15.75 v26.67,13.97 | J1.GND2 21,7.29 v21.08,7.37 | J1.GND 14.48,6.47 v14.48,7.37 | U2.27 19.56,22.57 v19.56,24.13 v20.38,24.13 U2.29 20.38,21.08 19.58,21.08 U2.27 | U2.35 22.78,24.13 v22.8,24.13 v23.56,24.13 23.58,24.13 U2.37 23.58,21.08 22.78,21.08 U2.35
  Top 0.406: v26.67,17.78 32.8,17.78 C1.2
  other vias: 7.62,86.36 7.62,83.82 8.89,82.55 8.89,81.28 8.89,78.74 10.16,77.47 12.7,77.47 13.97,78.74 13.97,81.28 13.97,82.55 15.24,83.82 15.24,86.36 20.32,86.36 20.32,83.82 21.59,82.55 21.59,81.28 21.59,78.74 22.86,77.47 25.4,77.47 26.67,78.74 26.67,81.28 26.67,82.55 27.94,83.82 27.94,86.36 7.62,85.09 8.89,80.01 15.24,85.09 13.97,80.01 11.43,77.47 20.32,85.09 27.94,85.09 26.67,80.01 21.59,80.01 24.13,77.47 7.18,29.21 16,29.21 19.18,29.21 22.42,29.21 24.77,29.21 9.21,24.13 17.21,24.13 11.56,24.13 28.77,29.21 25.97,24.13 32.38,25.4 32.38,20.95 3.17,25.4 3.17,20.95 8.89,13.97 11.43,13.97 15.24,12.7 20.32,12.7 15.24,17.14 19.05,18.16 20.32,17.14 2.54,11.43 1.91,10.16 5.08,8.26 7.62,5.08 33.66,11.43 32.38,6.35 16.51,18.16 11.43,5.08 29.21,1.27 7.62,1.27 1.27,5.08 34.29,5.08 26.67,11.43 8.89,11.43 16,9.4 19.56,9.4 8.89,17.78 33.66,19.68 31.11,17.78 27.94,20.32 6.35,20.32 5.08,34.29 8.89,34.29 12.7,34.29 16.51,34.29 20.32,34.29 24.13,34.29 26.67,34.29 8.89,39.37 5.08,39.37 12.7,39.37 16.51,39.37 20.32,39.37 24.13,39.37 5.08,41.91 12.7,41.91 16.51,41.91 20.32,41.91 5.08,44.45 8.89,44.45 20.32,45.72 20.32,48.26 16.51,48.26 12.7,48.26 8.89,46.99 5.08,46.99 5.08,49.53 8.89,49.53 5.08,52.07 8.89,52.07 12.7,52.07 16.51,52.07 19.05,50.8 1.91,15.88 29.84,15.75 28.57,12.06 30.48,34.29 30.48,29.21 28.57,13.97 23.5,6.35 26.67,7.62 8.89,7.62 19.05,20.83 16.51,20.83 6.35,13.97 7.62,41.91 10.16,41.91 3.81,17.78 5.08,17.78 31.11,20.07
  pour Top (isolate 0.178, rank 4): 0,0 0,88.9 35.56,88.9 35.56,0
  pour Bottom (isolate 0.178, rank 4): 0,0 0,88.9 35.56,88.9 35.56,0
GPIO1  (via drill 0.3)
  Top 0.152: v25.65,27.94 25.58,28.01 U2.42 25.58,36.65 24.13,38.1 J2.3
  Bottom 0.152: GPIO1.2 31.11,11.05 29.21,12.95 29.21,24.38 v25.65,27.94
GPS
  Top 0.813: GPS.FEED E2.SIG
N$2
  Top 0.152: R1.2 25.4,8.55 25.23,8.38 20.45,8.38 19.53,7.46 J1.B5
N$3
  Top 0.152: R2.2 10.16,8.55 10.83,7.87 16.26,7.87 16.53,7.6 J1.A5
N$5
  Top 0.152: R21.2 31.11,12.28 Q1.2 Q1.5 31.11,15.3 31.05,15.37 30.54,15.37 30.46,15.29 Q1.6
N$6  (via drill 0.3)
  Top 0.152: U1.10 15.37,15.59 C9.1 14.57,15.46 13.97,14.86 13.97,13.08 v12.95,12.06
  Bottom 0.152: RX_LED.1 22.48,10.16 20.95,11.68 14.61,11.68 13.08,10.16 TX_LED.2 12.59,11.7 v12.95,12.06
N$7  (via drill 0.3)
  Top 0.152: R4.1 v23.5,12.06
  Bottom 0.152: v23.5,12.06 24.02,11.54 RX_LED.2
N$9
  Top 0.152: R3.2 12.09,9.28 D2.A
N$10
  Top 0.152: D3.A 23.47,9.28 R4.2
N$12  (via drill 0.3)
  Top 0.152: R3.1 v12.06,12.06
  Bottom 0.152: TX_LED.1 11.54,11.54 v12.06,12.06
N$13  (via drill 0.3)
  Top 0.152: v31.88,19.68 32.06,19.5 Q2.1 | R22.2 32.8,13.97 v32.64,13.97 32.38,13.97 31.77,13.35 Q1.3
  Bottom 0.152: v31.88,19.68 31.88,16.76 33.02,15.62 33.02,14.35 v32.64,13.97
N$14  (via drill 0.3)
  Top 0.152: R5.1 29.08,9.87 v29.08,10.03
  Bottom 0.152: GPIO1.3 29.95,10.03 v29.08,10.03
N$15
  Top 0.152: Q3.2 Q3.5 4.45,11.64 4.66,11.43 R23.2 5.09,11.63 Q3.6
N$16  (via drill 0.3)
  Top 0.152: v33.15,10.03 33.15,9.91 32.38,9.14 R6.2
  Bottom 0.152: v33.15,10.03 32.28,10.03 GPIO1.1
N$28
  Top 0.152: Q4.1 3.79,16.48 Q3.3 1.96,14.77 R24.2
RXI  (via drill 0.3)
  Top 0.152: U2.11 9.98,24.12 v9.97,24.13 | v7.62,43.18 RXI.4
  Bottom 0.152: v9.97,24.13 10.29,24.45 10.29,40.51 v7.62,43.18 | RXI.4 RXI.2
SHLD  (via drill 0.3)
  Top 0.406: J1.SHLD3 v13.46,3.81
  Bottom 0.508: v13.46,3.81 SHLD.2
  pour Top (isolate 0.305, no thermals): 13.46,6.35 13.46,1.02 22.1,1.02 22.1,6.35
TX/!RX!  (via drill 0.3)
  Top 0.152: v15.24,39.37 13.97,40.64 J2.4 | v15.24,24.13 15.58,23.79 U2.17
  Bottom 0.152: v15.24,39.37 v15.24,24.13
TXO  (via drill 0.3)
  Top 0.152: U2.13 10.78,24.11 v10.79,24.13 | v10.16,48.26 TXO.3
  Bottom 0.152: v10.79,24.13 10.79,47.62 v10.16,48.26 | TXO.3 TXO.1
V_USB  (via drill 0.3)
  Top 0.152: D1.5 v17.78,9.78
  Top 0.406: J1.VBUS1 15.37,6.35 15.37,5.81 15.6,5.58 v15.6,4.09 15.88,3.81 19.3,3.81 19.81,4.32 v19.81,4.57 19.81,5.43 20.23,5.84 J1.VBUS2 20.23,7.59 20.61,7.98 22.23,7.98 v22.23,7.9 | F1.1 v24.13,3.81
  Bottom 0.152: v17.78,9.78 17.78,8.89 19.05,7.62 19.05,5.33 v19.81,4.57
  Bottom 0.406: BYP.2 v24.13,3.81 24.13,7.62 23.85,7.9 v22.23,7.9 | v15.6,4.09 15.11,3.61 JP1.VBUS
V_USB_2  (via drill 0.3)
  Top 0.152: U1.7 18.28,16.25 18.54,16.51 19.27,16.51 C10.1 | Q1.1 27.83,13.17 27.79,13.21
  Top 0.406: v29.21,3.81 F1.2 28.17,6.1 27.79,6.48 27.79,13.21 27.79,16.55 | C1.1 33.41,16.68 Q2.3 30.99,16.55 27.79,16.55 | C10.1 21.42,16.55 27.79,16.55
  Bottom 0.406: v29.21,3.81 BYP.1
VCC  (via drill 0.3)
  Top 0.152: Q3.4 3.09,13.17 v3.05,13.21 | Q2.2 30.16,19.5 v30.35,19.68 | v32.38,15.37 32.26,15.37 31.77,14.87 Q1.4
  Top 0.406: 13.34,19.9 10.5,19.9 10.16,19.56 C4.+ 10.02,19.05 7.62,19.05 5.39,16.82 Q4.2 7.62,14.55 v7.62,13.21 7.62,9.14 | 13.34,19.9 C3.1 C6.1 C7.1 25.31,19.9 25.4,19.81 C5.+ | 25.18,20.95 U2.41 25.18,24.51 29.54,28.87 29.54,30.73 U2.52 | 25.18,20.95 25.18,19.13 C5.+ | U2.2 6.38,28.67 8.38,26.67 11.43,26.67 13.34,24.77 13.34,19.9 | Q2.2 25.53,18.78 C5.+ | U2.39 24.38,21.21 24.64,20.95 25.18,20.95 | U3.1 7.3,7.3 7.62,7.62 7.62,9.14 | U3.3 7.56,9.21 7.62,9.14
  Bottom 0.152: v7.62,13.21 5.59,13.21 VCC.1 4.57,13.21 v3.05,13.21 | v30.35,19.68 30.35,17.4 v32.38,15.37
VHF
  Top 0.813: VHF.FEED E1.SIG
VIN
  Top 0.152: Q4.3 4.45,16.26 5.09,15.61 Q3.1
  Top 0.406: J2.2 2.54,35.56 3.81,34.29 3.81,30.48 1.27,27.94 1.27,19.27 C2.1 2.15,18.88 Q4.3

### Text on the board
Bottom: v10
Milling: Route Out | Route Out
Measures: Dimensions In Inches
tDocu: 2-Layer Board / 1.6mm Thickness / 1oz Copper / Lead-Free HASL Finish | Paul Clark | Revised By: Elias Santistevan